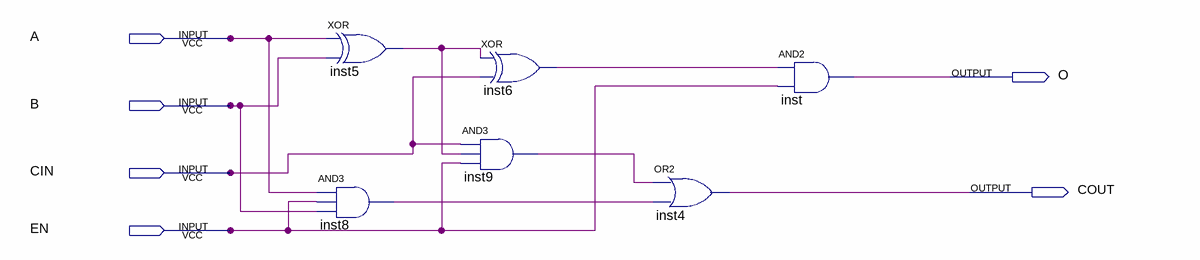
[diagram p0: schematic sheet]
// Quartus schematic FULL_ADDER_1bit.bdf as structural Verilog: 6 symbols, 6 pins
module FULL_ADDER_1bit (
  input  A,
  input  B,
  input  CIN,
  input  EN,
  output O,
  output COUT
);

  wire inst5_out, inst6_out, inst8_out, inst9_out;

  xor inst5 (inst5_out, A, B);
  and inst8 (inst8_out, A, EN, B);
  xor inst6 (inst6_out, inst5_out, CIN);
  and inst9 (inst9_out, CIN, inst5_out, EN);
  or inst4 (COUT, inst9_out, inst8_out);
  and inst (O, inst6_out, EN);
endmodule
